# Altium schematic sheet [4] Peripheral_Module.SchDoc
size A4; Organization: UNMEI ELECTRICAL; Address1: 16B/12 Nguyen Du Street; Address2: Da Lat City, LD Province; SheetNumber: 4; SheetTotal: 6
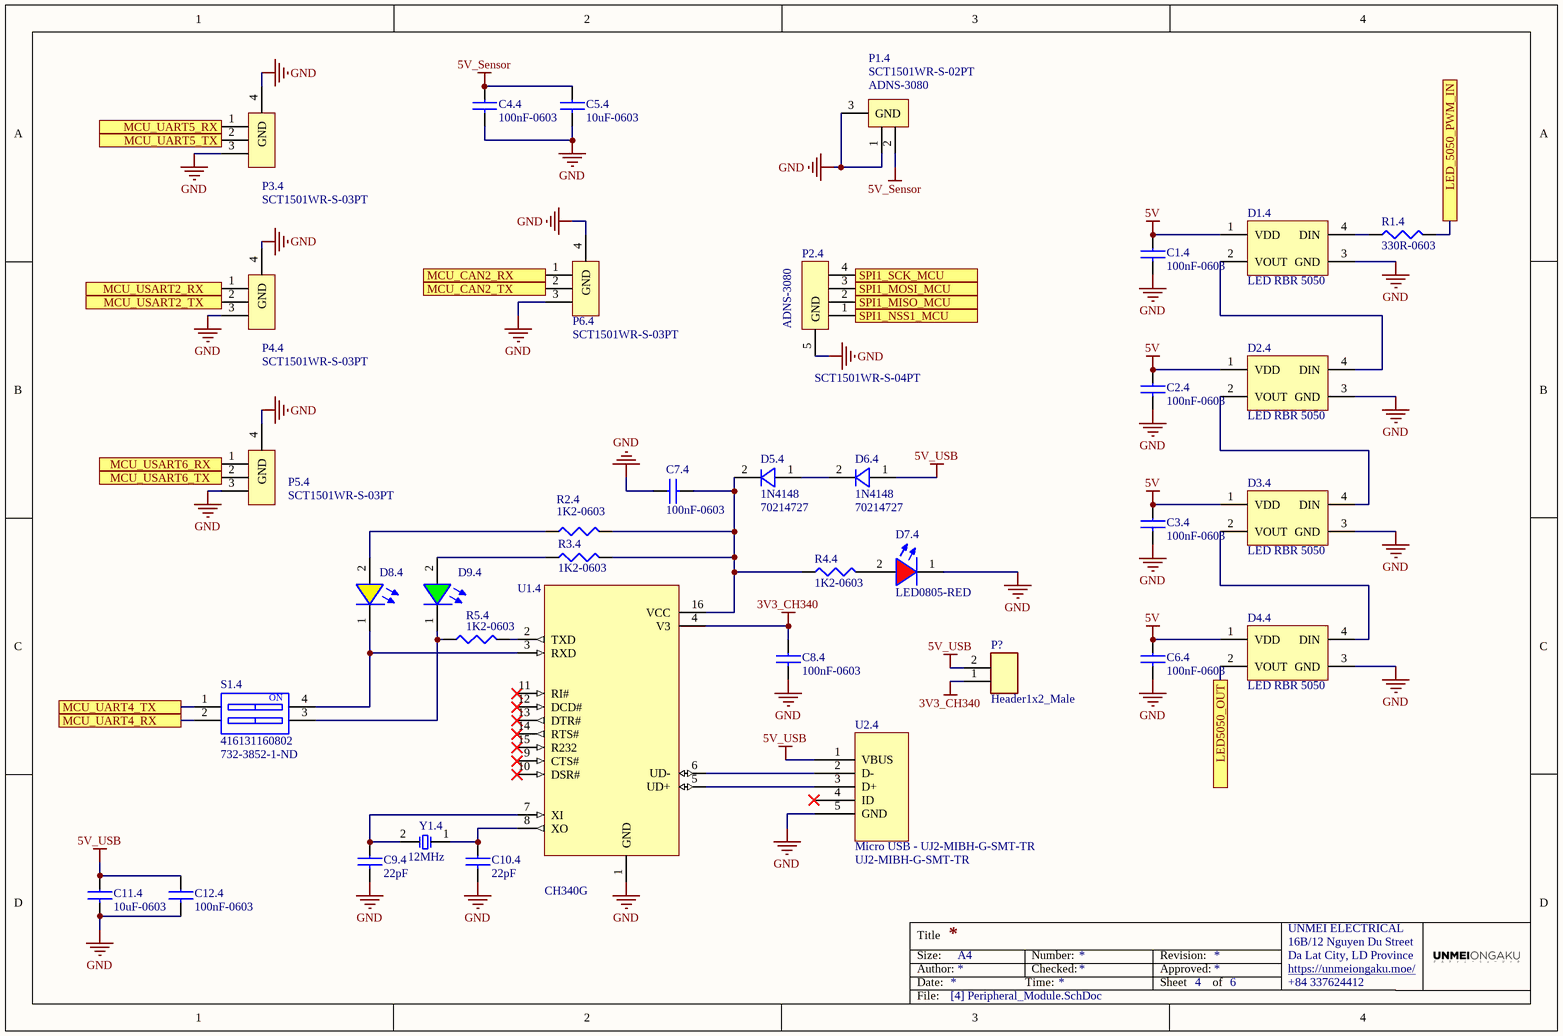
[diagram p0: [4] Peripheral_Module.SchDoc]

## Parts
C1.4  100nF-0603  [CAP0603]
C2.4  100nF-0603  [CAP0603]
C3.4  100nF-0603  [CAP0603]
C4.4  100nF-0603  [CAP0603]
C5.4  10uF-0603  [CAP0603]
C6.4  100nF-0603  [CAP0603]
C7.4  100nF-0603  [CAP0603]
C8.4  100nF-0603  [CAP0603]
C9.4  22pF  [CAP0603]
C10.4  22pF  [CAP0603]
C11.4  10uF-0603  [CAP0603]
C12.4  100nF-0603  [CAP0603]
D1.4  LED RBR 5050  [LED RGB  5050]
D2.4  LED RBR 5050  [LED RGB  5050]
D3.4  LED RBR 5050  [LED RGB  5050]
D4.4  LED RBR 5050  [LED RGB  5050]
D5.4  1N4148  Supplier Part Number 1: 70214727  [SOD-80]
D6.4  1N4148  Supplier Part Number 1: 70214727  [SOD-80]
D7.4  LED0805-RED  [LED0805-RED]
D8.4  YELLOW  [LED0805-YELLOW]  (value not drawn)
D9.4  GREEN  [LED0805-GREEN]  (value not drawn)
P1.4  SCT1501WR-S-02PT  [Connector ZH1.5 2P SMD]
P2.4  SCT1501WR-S-04PT  [Connector ZH1.5 4P SMD]
P3.4  SCT1501WR-S-03PT  [Connector ZH1.5 3P SMD]
P4.4  SCT1501WR-S-03PT  [Connector ZH1.5 3P SMD]
P5.4  SCT1501WR-S-03PT  [Connector ZH1.5 3P SMD]
P6.4  SCT1501WR-S-03PT  [Connector ZH1.5 3P SMD]
P?  Header1x2_Male  [HDR1x2_2.54_MALE]
R1.4  330R-0603  [RES0603 - 3D]
R2.4  1K2-0603  [RES0603 - 3D]
R3.4  1K2-0603  [RES0603 - 3D]
R4.4  1K2-0603  [RES0603 - 3D]
R5.4  1K2-0603  [RES0603 - 3D]
S1.4  416131160802  Supplier Part Number 1: 732-3852-1-ND  [DIP Switches SMD 1.27mm 2P]
U1.4  CH340G  [SOP16]
U2.4  Micro USB - UJ2-MIBH-G-SMT-TR  Supplier Part Number 1: UJ2-MIBH-G-SMT-TR  [Micro USB V2 SMD]
Y1.4  12MHz  [HC49-S]

## Ports
LED5050_OUT, LED_5050_PWM_IN, MCU_CAN2_RX, MCU_CAN2_TX, MCU_UART4_RX, MCU_UART4_TX, MCU_UART5_RX, MCU_UART5_TX, MCU_USART2_RX, MCU_USART2_TX, MCU_USART6_RX, MCU_USART6_TX, SPI1_MISO_MCU, SPI1_MOSI_MCU, SPI1_NSS1_MCU, SPI1_SCK_MCU

## Nets
3V3_CH340: C8.4.1 P?.1 U1.4.4(V3)
5V: C1.4.1 C2.4.1 C3.4.1 C6.4.1 D1.4.1(VDD) D2.4.1(VDD) D3.4.1(VDD) D4.4.1(VDD)
5V_Sensor: C4.4.1 C5.4.1 P1.4.2
5V_USB: C11.4.1 C12.4.1 D6.4.1(Anode) P?.2 U2.4.1(VBUS)
GND: C1.4.2 C2.4.2 C3.4.2 C4.4.2 C5.4.2 C6.4.2 C7.4.1 C8.4.2 C9.4.2 C10.4.2 C11.4.2 C12.4.2 D1.4.3(GND) D2.4.3(GND) D3.4.3(GND) D4.4.3(GND) D7.4.1(+) P1.4.1 P1.4.3(GND) P2.4.5(GND) P3.4.3 P3.4.4(GND) P4.4.3 P4.4.4(GND) P5.4.3 P5.4.4(GND) P6.4.3 P6.4.4(GND) U1.4.1(GND) U2.4.5(GND)
LED5050_OUT: D4.4.2(VOUT) ; port LED5050_OUT
LED_5050_PWM_IN: R1.4.2 ; port LED_5050_PWM_IN
MCU_CAN2_RX: P6.4.1 ; port MCU_CAN2_RX
MCU_CAN2_TX: P6.4.2 ; port MCU_CAN2_TX
MCU_UART4_RX: S1.4.2 ; port MCU_UART4_RX
MCU_UART4_TX: S1.4.1 ; port MCU_UART4_TX
MCU_UART5_RX: P3.4.1 ; port MCU_UART5_RX
MCU_UART5_TX: P3.4.2 ; port MCU_UART5_TX
MCU_USART2_RX: P4.4.1 ; port MCU_USART2_RX
MCU_USART2_TX: P4.4.2 ; port MCU_USART2_TX
MCU_USART6_RX: P5.4.1 ; port MCU_USART6_RX
MCU_USART6_TX: P5.4.2 ; port MCU_USART6_TX
SPI1_MISO_MCU: P2.4.2 ; port SPI1_MISO_MCU
SPI1_MOSI_MCU: P2.4.3 ; port SPI1_MOSI_MCU
SPI1_NSS1_MCU: P2.4.1 ; port SPI1_NSS1_MCU
SPI1_SCK_MCU: P2.4.4 ; port SPI1_SCK_MCU
NetC7.4_2: C7.4.2 D5.4.2(Cathode) R2.4.2 R3.4.2 R4.4.1 U1.4.16(VCC)
NetC9.4_1: C9.4.1 U1.4.7(XI) Y1.4.2
NetC10.4_1: C10.4.1 U1.4.8(XO) Y1.4.1
NetD1.4_2: D1.4.2(VOUT) D2.4.4(DIN)
NetD1.4_4: D1.4.4(DIN) R1.4.1
NetD2.4_2: D2.4.2(VOUT) D3.4.4(DIN)
NetD3.4_2: D3.4.2(VOUT) D4.4.4(DIN)
NetD5.4_1: D5.4.1(Anode) D6.4.2(Cathode)
NetD7.4_2: D7.4.2(+) R4.4.2
NetD8.4_1: D8.4.1(+) S1.4.4 U1.4.3(RXD)
NetD8.4_2: D8.4.2(+) R2.4.1
NetD9.4_1: D9.4.1(+) R5.4.1 S1.4.3
NetD9.4_2: D9.4.2(+) R3.4.1
NetR5.4_2: R5.4.2 U1.4.2(TXD)
NetU1.4_5: U1.4.5(UD+) U2.4.3(D+)
NetU1.4_6: U1.4.6(UD-) U2.4.2(D-)

Not connected (* = marked no-connect by the designer): U1.4 9(CTS#)* 10(DSR#)* 11(RI#)* 12(DCD#)* 13(DTR#)* 14(RTS#)* 15(R232)*; U2.4 4(ID)*

## Notes on the sheet
- (near P1.4) ADNS-3080
- (near P2.4) ADNS-3080
- Title
- Size:
- Date:
- Author:
- A4
- Time:
- Number:
- Checked:
- Revision:
- Sheet
- Approved:
- of
- https://unmeiongaku.moe/
- +84 337624412
- File:
- (in symbol 416131160802) ON

## Library data of the parts
C1.4 C2.4 C3.4 C6.4 = CC0603KRX7R0BB104: CAP CER 0.1UF 100V X7R 0603; Manufacturer: Yageo; Tolerance: ±10%; Value: 100nF; Supplier 1: Digi-Key; Manufacturer Part Number: CC0603KRX7R0BB104; RoHS: RoHS Compliant; Category: Capacitors; Stock 1: 784508; Pricing 1: 1=0.23, 10=0.156, 100=0.0791, 500=0.05414, 1000=0.0479 (USD); Packaging: Cut Tape (CT); Part Status: Active; Temperature Coefficient: X7R; Operating Temperature: -55°C ~ 125°C; Features: -; Ratings: -; Applications: General Purpose; Failure Rate: -; Mounting Type: Surface Mount, MLCC; Package / Case: 0603 (1608 Metric); Size / Dimension: 0.063" L x 0.032" W (1.60mm x 0.80mm); Height - Seated (Max): -; Thickness (Max): 0.035" (0.90mm); Lead Spacing: -; Lead Style: -; ComponentLink1URL: http://media.digikey.com/pdf/Data%20Sheets/Yageo%20PDFs/NPO,%20X7R%20Mid-voltage.pdf; ComponentLink1Description: http://media.digikey.com/pdf/Data%20Sheets/Yageo%20PDFs/NPO,%20X7R%20Mid-voltage.pdf; Supplier Part Number 1: 311-1523-1-ND; Voltage - Rated: 100V
C4.4 C7.4 C8.4 C12.4 = CC0603KRX7R9BB104: CAP CER 0.1UF 50V X7R 0603; Manufacturer 1: Yageo; Category 1: Capacitors; Capacitance: 0.1µF; Tolerance: ±10%; Value: 100nF; Supplier 1: Digi-Key; Supplier Part Number 1: 311-1344-1-ND; Manufacturer Part Number 1: CC0603KRX7R9BB104; RoHS 1: RoHS Compliant; Description 1: CAP CER 0.1UF 50V X7R 0603; Stock 1: 4411645; Pricing 1: 1=0.1, 10=0.031, 100=0.014, 500=0.00998, 1000=0.00783 (USD); Packaging: Cut Tape (CT); Part Status: Active; Voltage - Rated: 50V; Temperature Coefficient: X7R; Operating Temperature: -55°C ~ 125°C; Features: -; Ratings: -; Applications: General Purpose; Failure Rate: -; Mounting Type: Surface Mount, MLCC; Package / Case: 0603 (1608 Metric); Size / Dimension: 0.063" L x 0.031" W (1.60mm x 0.80mm); Height - Seated (Max): -; Thickness (Max): 0.035" (0.90mm); Lead Spacing: -; Lead Style: -; ComponentLink1URL: http://www.yageo.com/documents/recent/UPY-GPHC_X7R_6.3V-to-50V_18.pdf; ComponentLink1Description: http://www.yageo.com/documents/recent/UPY-GPHC_X7R_6.3V-to-50V_18.pdf
C5.4 C11.4 = CC0603KRX5R6BB106: CAP CER 10UF 10V X5R 0603; Manufacturer 1: Yageo; Category 1: Capacitors; Capacitance: 10µF; Tolerance: ±10%; Supplier 1: Digi-Key; Supplier Part Number 1: 311-1782-1-ND; Manufacturer Part Number 1: CC0603KRX5R6BB106; RoHS 1: RoHS Compliant; Description 1: CAP CER 10UF 10V X5R 0603; Stock 1: 66566; Pricing 1: 1=0.33, 10=0.225, 100=0.1272, 500=0.08982, 1000=0.07858 (USD); Packaging: Cut Tape (CT); Part Status: Active; Voltage - Rated: 10V; Temperature Coefficient: X5R; Operating Temperature: -55°C ~ 85°C; Features: -; Ratings: -; Applications: General Purpose; Failure Rate: -; Mounting Type: Surface Mount, MLCC; Package / Case: 0603 (1608 Metric); Size / Dimension: 0.063" L x 0.031" W (1.60mm x 0.80mm); Height - Seated (Max): -; Thickness (Max): 0.035" (0.90mm); Lead Spacing: -; Lead Style: -; ComponentLink1URL: http://www.yageo.com/documents/recent/UPY-GPHC_X5R_4V-to-50V_24.pdf; ComponentLink1Description: http://www.yageo.com/documents/recent/UPY-GPHC_X5R_4V-to-50V_24.pdf; Value: 10uF
C9.4 C10.4 = CC0603JRNPO9BN220: Surface Mount Ceramic Multilayer Capacitor 22pF 5% C0G 50V 0603 Paper T/R; Manufacturer: Yageo; Insulation Resistance: 10GR; Temperature Coefficient: 30ppm/°C; Supplier 1: Newark; Manufacturer Part Number: CC0603JRNPO9BN220; RoHS: Yes; Category: Ceramic Capacitors; Stock 1: 70605; Pricing 1: 1=0.10000, 10=0.02100, 25=0.02000, 50=0.01900, 100=0.01800 (USD); Mount: Surface Mount; Case/Package: 0603; Number of Pins: 2; Case Code (Imperial): 0603; Case Code (Metric): 1608; Min Operating Temperature: -55°C; Max Operating Temperature: 125°C; Capacitance: 22pF; Tolerance: 5%; Voltage Rating: 50V; Packaging: Tape and Reel; Dielectric: C0G; Termination: SMD/SMT; Series: CC; Voltage Rating (DC): 50V; Package Quantity: 1; Voltage: 50V; Length: 1.6mm; Width: 0.031inch; Height: 0.8mm; Thickness: 0.035inch; Depth: 0.8mm; Radiation Hardening: No; Lead Free: Lead Free; RoHS Compliant: Yes; Reach SVHC Compliant: Yes; Supplier Part Number 1: 46WX087
D1.4 D2.4 D3.4 D4.4 = LED RBR 5050 - IN-PI55QATPRPGPBPW-60: Address Led Discrete Serial Rgbw; Manufacturer: Inolux; Color: White,Blue,Green,Red; Lens Style: Round,Flat; Luminous Intensity: 1850mcd; Forward Voltage: 5.2V; Test Current: 12mA; Dominant Wavelength: 465nm; Supplier 1: Arrow Electronics; Manufacturer Part Number: IN-PI55QATPRPGPBPW-60; RoHS: No; Category: LEDs; Stock 1: 964; Pricing 1: 1=0.71450, 10=0.46990, 25=0.46520, 100=0.30470, 250=0.30220, 500=0.29430 (USD); Mount: Surface Mount; Case/Package: SMD/SMT; Packaging: Tape and Reel; Length: 5mm; Width: 5mm; Height: 1.7mm; ComponentLink1URL: http://www.inolux-corp.com/datasheet/SMDLED/Addressable%20LED/IN-PI55QATPRPGPBPW-XX_v1.2.pdf?src-supplier=Digi-Key; ComponentLink1Description: http://www.inolux-corp.com/datasheet/SMDLED/Addressable%20LED/IN-PI55QATPRPGPBPW-XX_v1.2.pdf?src-supplier=Digi-Key; Supplier Part Number 1: IN-PI55QATPRPGPBPW-60
D5.4 D6.4 = 1N4148: Rectifier Diode Small Signal Switching 100V 0.2A 4ns Automotive 2-Pin DO-35 Ammo; Manufacturer: NTE Electronics; Forward Voltage: 1V; Element Configuration: Single; Max Repetitive Reverse Voltage (Vrrm): 75V; Forward Current: 300mA; Current Rating: 200mA; Polarity: Standard; Capacitance: 4pF; Max Forward Surge Current (Ifsm): 1A; Power Dissipation: 500mW; Supplier 1: Allied Electronics; Manufacturer Part Number: 1N4148; RoHS: Yes; Category: Rectifier Diodes; Stock 1: 5690; Pricing 1: 1=0.08800 (USD); Mount: Through Hole; Case/Package: DO-35; Number of Pins: 2; Min Operating Temperature: -65°C; Max Operating Temperature: 175°C; Packaging: Tape and Reel; Reverse Recovery Time: 4ns; Voltage Rating (DC): 100V; Output Current: 200mA; Diameter: 2mm; Length: 4mm; RoHS Compliant: Yes; Lead Free: Lead Free; ComponentLink1URL: https://datasheet.ciiva.com/7624/1n4148-4448-7624426.pdf?src-supplier=Element14; ComponentLink1Description: https://datasheet.ciiva.com/7624/1n4148-4448-7624426.pdf?src-supplier=Element14
D8.4 = LED0805-YELLOW
D9.4 = LED0805-GREEN
P? = HDR1x2_2.54_MALE: Header1x2_2.54_MALE
R1.4 = RC0603JR-07330RL: RES SMD 330 OHM 5% 1/10W 0603; Manufacturer 1: Yageo; Category 1: Resistors; Resistance (Ohms): 330; Power (Watts): 0.1W, 1/10W; Temperature Coefficient: ±100ppm/°C; Value: 330R; Supplier 1: Digi-Key; Supplier Part Number 1: 311-330GRCT-ND; Manufacturer Part Number 1: RC0603JR-07330RL; RoHS 1: RoHS Compliant; Description 1: RES SMD 330 OHM 5% 1/10W 0603; Stock 1: 1463213; Pricing 1: 1=0.1, 10=0.011, 100=0.0046, 1000=0.00207, 2500=0.0018 (USD); Packaging: Cut Tape (CT); Part Status: Active; Tolerance: ±5%; Composition: Thick Film; Features: Moisture Resistant; Operating Temperature: -55°C ~ 155°C; Package / Case: 0603 (1608 Metric); Supplier Device Package: 0603; Size / Dimension: 0.063" L x 0.031" W (1.60mm x 0.80mm); Height - Seated (Max): 0.022" (0.55mm); Failure Rate: -; ComponentLink1URL: http://www.yageo.com/documents/recent/PYu-RC_Group_51_RoHS_L_7.pdf; ComponentLink1Description: http://www.yageo.com/documents/recent/PYu-RC_Group_51_RoHS_L_7.pdf
R2.4 R3.4 R4.4 R5.4 = RC0603JR-071K2L: RES SMD 1.2K OHM 5% 1/10W 0603; Manufacturer 1: Yageo; Category 1: Resistors; Power (Watts): 0.1W, 1/10W; Temperature Coefficient: ±100ppm/°C; Value: 1K2; Supplier 1: Digi-Key; Supplier Part Number 1: 311-1.2KGRCT-ND; Manufacturer Part Number 1: RC0603JR-071K2L; RoHS 1: RoHS Compliant; Description 1: RES SMD 1.2K OHM 5% 1/10W 0603; Stock 1: 286942; Pricing 1: 1=0.1, 10=0.011, 100=0.0046, 1000=0.00207, 2500=0.0018 (USD); Packaging: Cut Tape (CT); Part Status: Active; Resistance (Ohms): 1.2k; Tolerance: ±5%; Composition: Thick Film; Features: Moisture Resistant; Operating Temperature: -55°C ~ 155°C; Package / Case: 0603 (1608 Metric); Supplier Device Package: 0603; Size / Dimension: 0.063" L x 0.031" W (1.60mm x 0.80mm); Height - Seated (Max): 0.022" (0.55mm); Failure Rate: -; ComponentLink1URL: http://www.yageo.com/documents/recent/PYu-RC_Group_51_RoHS_L_7.pdf; ComponentLink1Description: http://www.yageo.com/documents/recent/PYu-RC_Group_51_RoHS_L_7.pdf
S1.4 = 416131160802: DIP Switch Dimensions L x W x H: 5.6 x 2 mm Series: WS-DISV L: 3.58 mm Poles: 2; Manufacturer: Wurth Electronics; Body Material: Polyphenylene,Polyphthalamide; Mechanical Life: 2000Cycles; Contact Current Rating: 25mA; Contact Resistance: 50mR; Number of Positions: 2; Voltage Rating (DC): 24V; Electrical Life: 1000Cycles; Throw Configuration: SPST; Insulation Resistance: 100MR; Actuator Type: Slide (Standard); Pitch: 0.05inch; Washable: Yes; Supplier 1: Digi-Key; Manufacturer Part Number: 416131160802; RoHS: Yes; Category: DIP Switches; Stock 1: 2793; Pricing 1: 1=5.06000, 10=4.81100, 50=4.55800, 100=4.05100, 500=3.79800 (USD); Mount: Surface Mount; Contact Material: Copper Alloy,Gold; Contact Plating: Gold; Min Operating Temperature: -40°C; Max Operating Temperature: 85°C; Package Quantity: 1; Packaging: Cut Tape; Current Rating: 25mA; Termination: Gull Wing; Number of Circuits: 2; Max Voltage Rating (DC): 24V; Series: WS-DISV; Length: 0.141inch; Width: 5.6mm; Height: 2mm; Lead Free: Lead Free; RoHS Compliant: Yes; ComponentLink1URL: https://datasheet.ciiva.com/30467/0900766b812902d9-30467106.pdf?src-supplier=RSComponents; ComponentLink1Description: https://datasheet.ciiva.com/30467/0900766b812902d9-30467106.pdf?src-supplier=RSComponents; ComponentLink2URL: https://datasheet.ciiva.com/2863/4161311608xx-2863669.pdf?src-supplier=Digi-Key; ComponentLink2Description: https://datasheet.ciiva.com/2863/4161311608xx-2863669.pdf?src-supplier=Digi-Key; ComponentLink3URL: https://datasheet.ciiva.com/2863/4161311608xx-2863670.pdf?src-supplier=Digi-Key; ComponentLink3Description: https://datasheet.ciiva.com/2863/4161311608xx-2863670.pdf?src-supplier=Digi-Key
U1.4 = CH340G: USB2UART
U2.4 = Micro USB - UJ2-MIBH-G-SMT-TR: Conn Micro USB 2.0 Type B RCP 5 POS 0.65mm Solder RA SMD 5 Terminal 1 Port T/R; Manufacturer: CUI Devices; Supplier 1: Arrow Electronics; Manufacturer Part Number: UJ2-MIBH-G-SMT-TR; RoHS: Yes; Category: USB Connectors; Stock 1: 6066; Pricing 1: 1=0.44640, 10=0.33470, 25=0.33130, 50=0.32680, 100=0.29350, 250=0.28070, 500=0.26500, 1000=0.21660, 2000=0.19850, 3000=0.19000, 5000=0.18820 (USD)
Y1.4 = Crystals - HC49SSDLF-8.00MHz: Crystals LO-PRO 8MHz; Manufacturer: Fox Electronics; Supplier 1: Mouser; Manufacturer Part Number: HC49SSDLF-8.00MHz; RoHS: Yes; Category: Uncategorized; Frequency: 8MHz; Packaging: Tape and Reel; Package Quantity: 1000; Termination: SMD/SMT; Length: 13.2mm; Width: 5mm; Height: 3.2mm; ComponentLink1URL: https://datasheet.ciiva.com/12388/hc49ssdlf-16337-12388064.pdf?src-supplier=Mouser; ComponentLink1Description: https://datasheet.ciiva.com/12388/hc49ssdlf-16337-12388064.pdf?src-supplier=Mouser; Supplier Part Number 1: 559-280LF-080